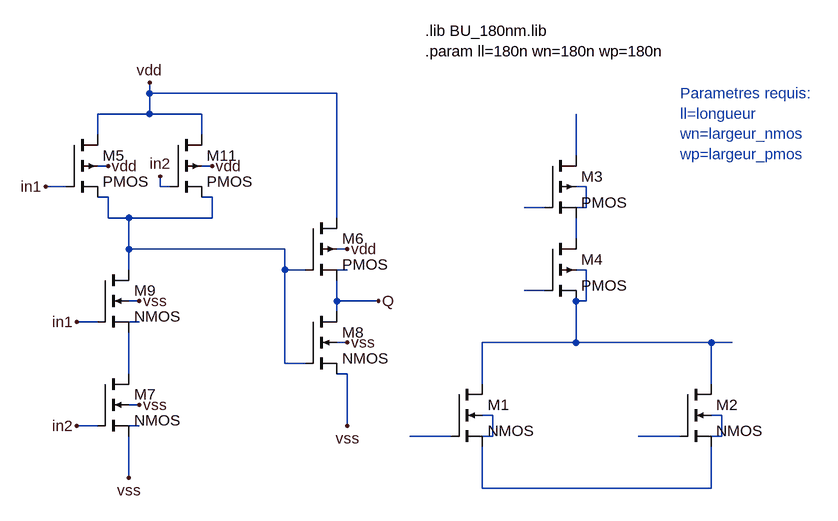
[diagram p0: schematic nor - Copy.asc]
nor - Copy.asc, the LTspice schematic file:
Version 4
SHEET 1 1192 940
WIRE -240 192 -240 176
WIRE 48 192 -240 192
WIRE -240 224 -240 192
WIRE -240 224 -320 224
WIRE -160 224 -240 224
WIRE -320 256 -320 224
WIRE -160 256 -160 224
WIRE 416 288 416 224
WIRE -304 304 -320 304
WIRE -144 304 -160 304
WIRE -368 336 -400 336
WIRE -224 336 -224 320
WIRE -208 336 -224 336
WIRE 432 336 416 336
WIRE -304 352 -320 352
WIRE -144 352 -160 352
WIRE 368 368 336 368
WIRE 432 368 432 336
WIRE 432 368 416 368
WIRE -304 384 -304 352
WIRE -272 384 -304 384
WIRE -144 384 -144 352
WIRE -144 384 -272 384
WIRE 48 384 48 192
WIRE 416 416 416 384
WIRE -272 432 -272 384
WIRE -32 432 -272 432
WIRE 64 432 48 432
WIRE -272 464 -272 432
WIRE -32 464 -32 432
WIRE 0 464 -32 464
WIRE 64 464 48 464
WIRE 432 464 416 464
WIRE 368 496 336 496
WIRE -256 512 -272 512
WIRE 48 512 48 480
WIRE 112 512 48 512
WIRE 432 512 432 464
WIRE 432 512 416 512
WIRE 48 528 48 512
WIRE -320 544 -352 544
WIRE -256 544 -272 544
WIRE 64 576 48 576
WIRE 416 576 416 512
WIRE 416 576 272 576
WIRE 624 576 416 576
WIRE 656 576 624 576
WIRE -32 608 -32 464
WIRE 0 608 -32 608
WIRE -272 624 -272 560
WIRE 64 624 48 624
WIRE 272 640 272 576
WIRE 624 640 624 576
WIRE -256 672 -272 672
WIRE 288 688 272 688
WIRE 640 688 624 688
WIRE -320 704 -352 704
WIRE -256 704 -272 704
WIRE 64 704 64 624
WIRE 224 720 160 720
WIRE 288 720 288 688
WIRE 288 720 272 720
WIRE 576 720 512 720
WIRE 640 720 640 688
WIRE 640 720 624 720
WIRE -272 784 -272 720
WIRE 272 800 272 736
WIRE 624 800 624 736
WIRE 624 800 272 800
FLAG -240 176 vdd
FLAG -272 784 vss
FLAG 64 704 vss
FLAG 112 512 Q
FLAG -400 336 in1
FLAG -352 544 in1
FLAG -352 704 in2
FLAG -224 320 in2
FLAG -304 304 vdd
FLAG 64 432 vdd
FLAG -256 672 vss
FLAG 64 576 vss
FLAG -144 304 vdd
FLAG -256 512 vss
SYMBOL nmos4 576 640 R0
SYMATTR InstName M2
SYMATTR Value2 l={ll} w={wn} ad={450n*{wn}} as={450n*{wn}} pd={900n+{wn}} ps={1080n+{wn}}
SYMBOL nmos4 224 640 R0
SYMATTR InstName M1
SYMATTR Value2 l={ll} w={wn} ad={450n*{wn}} as={450n*{wn}} pd={900n+{wn}} ps={1080n+{wn}}
SYMBOL pmos4 368 288 R0
SYMATTR InstName M3
SYMATTR Value2 l={ll} w={wp} ad={450n*{wp}} as={450n*{wp}} pd={900n+{wp}} ps={1080n+{wp}}
SYMBOL pmos4 368 416 R0
SYMATTR InstName M4
SYMATTR Value2 l={ll} w={wp} ad={450n*{wp}} as={450n*{wp}} pd={900n+{wp}} ps={1080n+{wp}}
SYMBOL pmos4 -368 256 R0
SYMATTR InstName M5
SYMATTR Value2 l={ll} w={wp} ad={450*{wp}} as={450*{wp}} pd={900+{wp}} ps={1080+{wp}}
SYMBOL nmos4 -320 464 R0
SYMATTR InstName M9
SYMATTR Value2 l={ll} w={wn} ad={450*{wn}} as={450*{wn}} pd={900+{wn}} ps={1080+{wn}}
SYMBOL pmos4 -208 256 R0
SYMATTR InstName M11
SYMATTR Value2 l={ll} w={wp} ad={450*{wp}} as={450*{wp}} pd={900+{wp}} ps={1080+{wp}}
SYMBOL pmos4 0 384 R0
SYMATTR InstName M6
SYMATTR Value2 l={ll} w={wp} ad={450*{wp}} as={450*{wp}} pd={900+{wp}} ps={1080+{wp}}
SYMBOL nmos4 -320 624 R0
SYMATTR InstName M7
SYMATTR Value2 l={ll} w={wn} ad={450*{wn}} as={450*{wn}} pd={900+{wn}} ps={1080+{wn}}
SYMBOL nmos4 0 528 R0
SYMATTR InstName M8
SYMATTR Value2 l={ll} w={wn} ad={450*{wn}} as={450*{wn}} pd={900+{wn}} ps={1080+{wn}}
TEXT 184 96 Left 2 !.lib BU_180nm.lib\n.param ll=180n wn=180n wp=180n
TEXT 576 192 Left 2 ;Parametres requis: \nll=longueur \nwn=largeur_nmos \nwp=largeur_pmos

The netlist it stands for:
* nor - Copy.asc
M2 N007 N015 N016 N012 NMOS l={ll} w={wn} ad={450n*{wn}} as={450n*{wn}} pd={900n+{wn}} ps={1080n+{wn}}
M1 N007 N014 N016 N011 NMOS l={ll} w={wn} ad={450n*{wn}} as={450n*{wn}} pd={900n+{wn}} ps={1080n+{wn}}
M3 N001 N004 N005 N002 PMOS l={ll} w={wp} ad={450n*{wp}} as={450n*{wp}} pd={900n+{wp}} ps={1080n+{wp}}
M4 N005 N008 N007 N007 PMOS l={ll} w={wp} ad={450n*{wp}} as={450n*{wp}} pd={900n+{wp}} ps={1080n+{wp}}
M5 vdd in1 N003 vdd PMOS l={ll} w={wp} ad={450*{wp}} as={450*{wp}} pd={900+{wp}} ps={1080+{wp}}
M9 N003 in1 N010 vss NMOS l={ll} w={wn} ad={450*{wn}} as={450*{wn}} pd={900+{wn}} ps={1080+{wn}}
M11 vdd in2 N003 vdd PMOS l={ll} w={wp} ad={450*{wp}} as={450*{wp}} pd={900+{wp}} ps={1080+{wp}}
M6 vdd N003 Q vdd PMOS l={ll} w={wp} ad={450*{wp}} as={450*{wp}} pd={900+{wp}} ps={1080+{wp}}
M7 N010 in2 vss vss NMOS l={ll} w={wn} ad={450*{wn}} as={450*{wn}} pd={900+{wn}} ps={1080+{wn}}
M8 Q N003 vss vss NMOS l={ll} w={wn} ad={450*{wn}} as={450*{wn}} pd={900+{wn}} ps={1080+{wn}}
.model NMOS NMOS
.model PMOS PMOS
.lib standard.mos
.lib BU_180nm.lib
.param ll=180n wn=180n wp=180n
* Parametres requis:
* ll=longueur
* wn=largeur_nmos
* wp=largeur_pmos
.backanno
.end